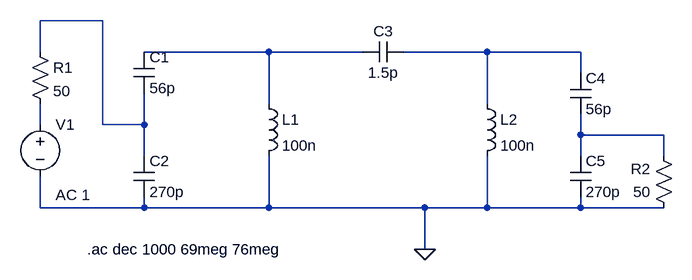
[diagram p0: schematic bandpass-filter-if.asc]
bandpass-filter-if.asc, the LTspice schematic file:
Version 4
SHEET 1 1080 680
WIRE 64 48 -32 48
WIRE -32 96 -32 48
WIRE 320 96 128 96
WIRE 464 96 320 96
WIRE 656 96 528 96
WIRE 800 96 656 96
WIRE 800 128 800 96
WIRE 320 176 320 96
WIRE 656 176 656 96
WIRE -32 208 -32 176
WIRE 64 208 64 48
WIRE 128 208 128 160
WIRE 128 208 64 208
WIRE 800 224 800 192
WIRE 928 224 800 224
WIRE 128 256 128 208
WIRE 800 256 800 224
WIRE 928 256 928 224
WIRE -32 336 -32 288
WIRE 128 336 128 320
WIRE 128 336 -32 336
WIRE 320 336 320 256
WIRE 320 336 128 336
WIRE 560 336 320 336
WIRE 656 336 656 256
WIRE 656 336 560 336
WIRE 800 336 800 320
WIRE 800 336 656 336
WIRE 928 336 800 336
WIRE 560 400 560 336
FLAG 560 400 0
SYMBOL voltage -32 192 R0
WINDOW 123 24 124 Left 2
WINDOW 39 0 0 Left 0
SYMATTR Value2 AC 1
SYMATTR InstName V1
SYMATTR Value ""
SYMBOL cap 112 96 R0
SYMATTR InstName C1
SYMATTR Value 56p
SYMBOL cap 112 256 R0
SYMATTR InstName C2
SYMATTR Value 270p
SYMBOL ind 304 160 R0
SYMATTR InstName L1
SYMATTR Value 100n
SYMBOL cap 464 80 M90
WINDOW 0 0 32 VBottom 2
WINDOW 3 32 32 VTop 2
SYMATTR InstName C3
SYMATTR Value 1.5p
SYMBOL cap 784 128 R0
SYMATTR InstName C4
SYMATTR Value 56p
SYMBOL cap 784 256 R0
SYMATTR InstName C5
SYMATTR Value 270p
SYMBOL res -48 80 R0
SYMATTR InstName R1
SYMATTR Value 50
SYMBOL res 944 352 R180
WINDOW 0 36 76 Left 2
WINDOW 3 36 40 Left 2
SYMATTR InstName R2
SYMATTR Value 50
SYMBOL ind 640 160 R0
SYMATTR InstName L2
SYMATTR Value 100n
TEXT 40 400 Left 2 !.ac dec 1000 69meg 76meg

The netlist it stands for:
* bandpass-filter-if.asc
V1 N004 0 AC 1
C1 N002 N001 56p
C2 N001 0 270p
L1 N002 0 100n
C3 N002 N003 1.5p
C4 N003 N005 56p
C5 N005 0 270p
R1 N001 N004 50
R2 0 N005 50
L2 N003 0 100n
.ac dec 1000 69meg 76meg
.backanno
.end